# EAGLE design SDC project (EAGLE 9.1.3)
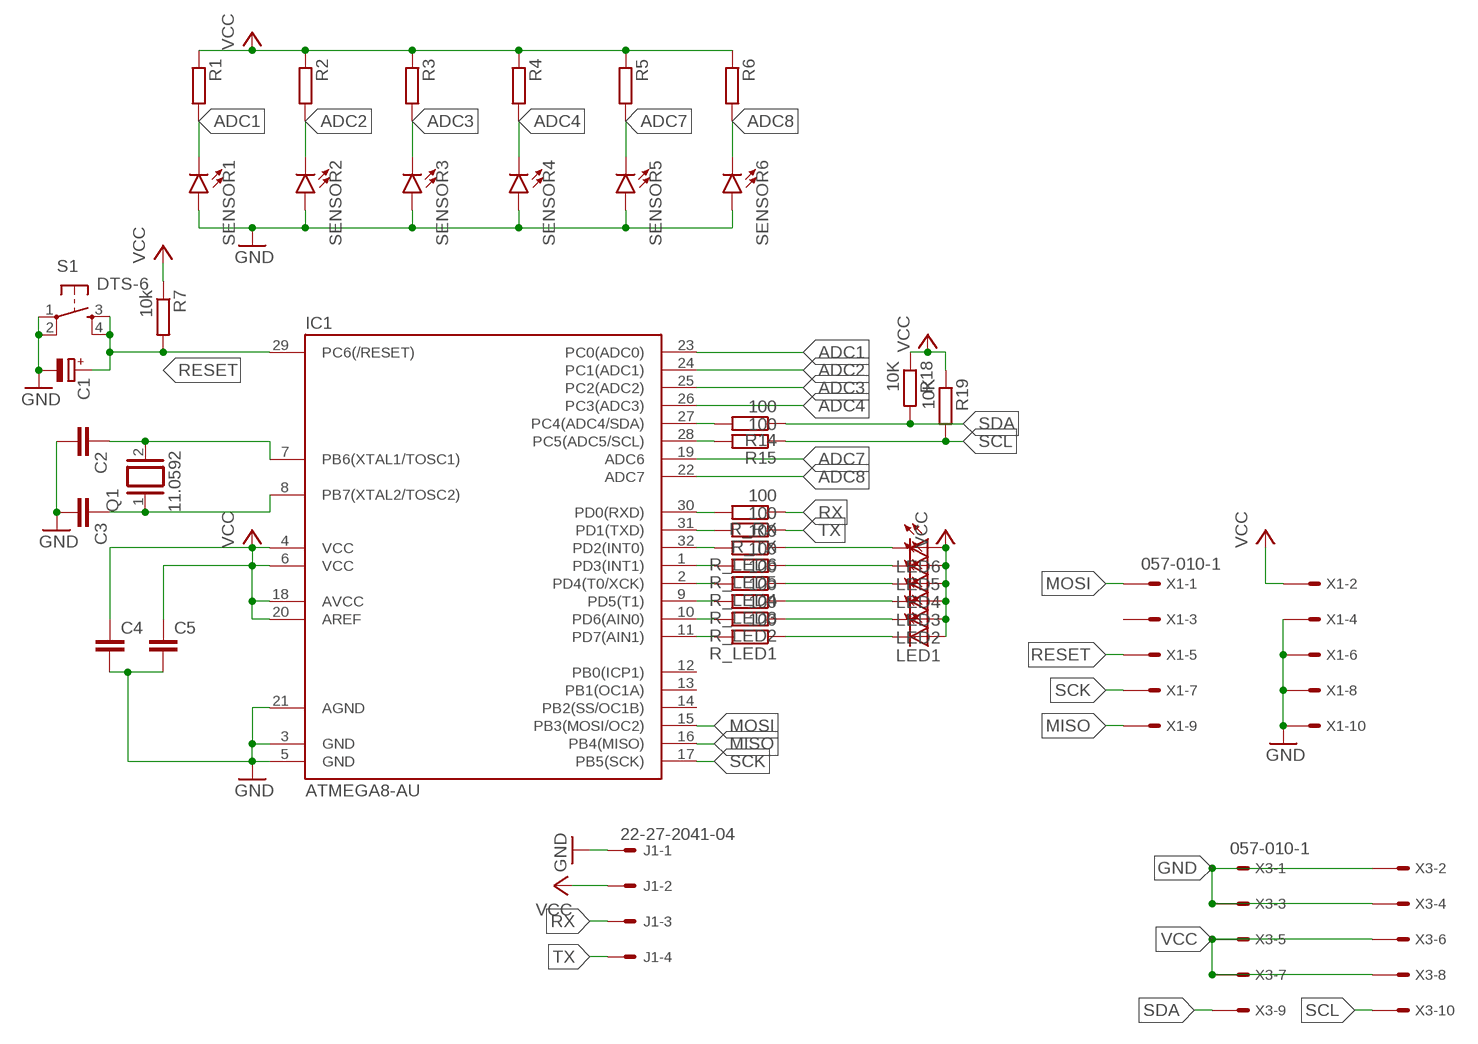
[diagram p0: schematic, sheet 1]

## Parts
C1  CPOL-EUE2.5-5  [E2,5-5]
C2  C5/2.5  [C5B2.5]
C3  C5/2.5  [C5B2.5]
C4  C-EUC1206  [C1206]
C5  C-EUC1206  [C1206]
IC1  ATMEGA8-AU  [TQFP32-08]
J1  22-27-2041-04  [6410-04]
LED1  LEDSML0805  [SML0805]
LED2  LEDSML0805  [SML0805]
LED3  LEDSML0805  [SML0805]
LED4  LEDSML0805  [SML0805]
LED5  LEDSML0805  [SML0805]
LED6  LEDSML0805  [SML0805]
Q1  11.0592  XTAL/S  [QS]
R1  R-EU_R0805  [R0805]
R2  R-EU_R0805  [R0805]
R3  R-EU_R0805  [R0805]
R4  R-EU_R0805  [R0805]
R5  R-EU_R0805  [R0805]
R6  R-EU_R0805  [R0805]
R7  10k  R-EU_R0805  [R0805]
R14  100  R-EU_R0805  [R0805]
R15  100  R-EU_R0805  [R0805]
R18  10K  R-EU_R0805  [R0805]
R19  10K  R-EU_R0805  [R0805]
R_LED1  100  R-EU_R0805  [R0805]
R_LED2  100  R-EU_R0805  [R0805]
R_LED3  100  R-EU_R0805  [R0805]
R_LED4  100  R-EU_R0805  [R0805]
R_LED5  100  R-EU_R0805  [R0805]
R_LED6  100  R-EU_R0805  [R0805]
R_RX  100  R-EU_R0805  [R0805]
R_TX  100  R-EU_R0805  [R0805]
S1  DTS-6  [DTS-6]
SENSOR1  LED5MM  [LED_5MM]
SENSOR2  LED5MM  [LED_5MM]
SENSOR3  LED5MM  [LED_5MM]
SENSOR4  LED5MM  [LED_5MM]
SENSOR5  LED5MM  [LED_5MM]
SENSOR6  LED5MM  [LED_5MM]
X1  057-010-1  [057-010-1]
X3  057-010-1  [057-010-1]

## Nets
ADC1: IC1.23(PC0(ADC0)) R1.2 SENSOR1.K(C)
ADC2: IC1.24(PC1(ADC1)) R2.2 SENSOR2.K(C)
ADC3: IC1.25(PC2(ADC2)) R3.2 SENSOR3.K(C)
ADC4: IC1.26(PC3(ADC3)) R4.2 SENSOR4.K(C)
ADC7: IC1.19(ADC6) R5.2 SENSOR5.K(C)
ADC8: IC1.22(ADC7) R6.2 SENSOR6.K(C)
GND: C1.- C2.2 C3.2 C4.2 C5.2 IC1.3(GND) IC1.5(GND) IC1.21(AGND) J1.1 S1.1 S1.2 SENSOR1.A SENSOR2.A SENSOR3.A SENSOR4.A SENSOR5.A SENSOR6.A X1.4 X1.6 X1.8 X1.10 X3.1 X3.2 X3.3 X3.4
MISO: IC1.16(PB4(MISO)) X1.9
MOSI: IC1.15(PB3(MOSI/OC2)) X1.1
N$1: IC1.30(PD0(RXD)) R_RX.2
N$2: IC1.31(PD1(TXD)) R_TX.2
N$7: IC1.27(PC4(ADC4/SDA)) R14.2
N$8: C2.1 IC1.7(PB6(XTAL1/TOSC1)) Q1.2
N$9: C3.1 IC1.8(PB7(XTAL2/TOSC2)) Q1.1
N$10: IC1.28(PC5(ADC5/SCL)) R15.2
N$13: IC1.32(PD2(INT0)) R_LED6.2
N$14: IC1.1(PD3(INT1)) R_LED5.2
N$15: IC1.2(PD4(T0/XCK)) R_LED4.2
N$16: IC1.9(PD5(T1)) R_LED3.2
N$17: IC1.10(PD6(AIN0)) R_LED2.2
N$18: IC1.11(PD7(AIN1)) R_LED1.2
N$19: LED6.C R_LED6.1
N$20: LED5.C R_LED5.1
N$21: LED4.C R_LED4.1
N$22: LED3.C R_LED3.1
N$23: LED2.C R_LED2.1
N$24: LED1.C R_LED1.1
RESET: C1.+ IC1.29(PC6(/RESET)) R7.2 S1.3 S1.4 X1.5
RX: J1.3 R_RX.1
SCK: IC1.17(PB5(SCK)) X1.7
SCL: R15.1 R19.2 X3.10
SDA: R14.1 R18.2 X3.9
TX: J1.4 R_TX.1
VCC: C4.1 C5.1 IC1.4(VCC) IC1.6(VCC) IC1.18(AVCC) IC1.20(AREF) J1.2 LED1.A LED2.A LED3.A LED4.A LED5.A LED6.A R1.1 R2.1 R3.1 R4.1 R5.1 R6.1 R7.1 R18.1 R19.1 X1.2 X3.5 X3.6 X3.7 X3.8
Unconnected: IC1.12(PB0(ICP1)) IC1.13(PB1(OC1A)) IC1.14(PB2(SS/OC1B)) X1.3

## Library data of the parts
C1 = rcl:CPOL-EU: POLARIZED CAPACITOR, European symbol; SPICEPREFIX: C
C2 C3 = capacitor-wima:C: CAPACITOR naming: grid - package width
C4 C5 = rcl:C-EU: CAPACITOR, European symbol; SPICEPREFIX: C
IC1 = atmega8:ATMEGA8
J1 = con-molex:22-?-04: CONNECTOR wire to board 2.54 mm (.1 inch) pitch header; MF: MOLEX; OC_FARNELL: unknown; OC_NEWARK: unknown
LED1-LED6 = led:LED: LED OSRAM: - CHIPLED LG R971, LG N971, LY N971, LG Q971, LY Q971, LO R971, LY R971 LH N974, LH R974 LS Q976, LO Q976, LY Q976 LO Q996 - Hyper CHIPLED LW Q18S LB Q993, LB Q99A, LB R99A - SideLED LS A670, LO A670, LY A670, LG A670, LP A670 LB A673, LV A673, LT A673, LW A673 LH A674 LY A675 LS A676, LA A676, LO A676, LY A676, LW A676 LS A679, LY A679, LG A679 - Hyper Micro SIDELED® LS Y876, LA Y876, LO Y876, LY Y876 LT Y87S - SmartLED LW L88C, LW L88S LB L89C, LB L89S, LG L890 LS L89K, LO L89K, LY L89K LS L896, LA L896, LO L896, LY L896 - TOPLED LS T670, LO T670, LY T670, LG T670, LP T670 LSG T670, LSP T670, LSY T670, LOP T670, LYG T670 LG T671, LOG T671, LSG T671 LB T673, LV T673, LT T673, LW T673 LH T674 LS T676, LA T676, LO T676, LY T676, LB T676, LH T676, LSB T676, LW T676 LB T67C, LV T67C, LT T67C, LS T67K, LO T67K, LY T67K, LW E67C LS E67B, LA E67B, LO E67B, LY E67B, LB E67C, LV E67C, LT E67C LW T67C LS T679, LY T679, LG T679 LS T770, LO T770, LY T770, LG T770, LP T770 LB T773, LV T773, LT T773, LW T773 LH T774 LS E675, LA E675, LY E675, LS T675 LS T776, LA T776, LO T776, LY T776, LB T776 LHGB T686 LT T68C, LB T68C - Hyper Mini TOPLED® LB M676 - Mini TOPLED Santana® LG M470 LS M47K, LO M47K, LY M47K Source: http://www.osram.convergy.de LUXEON: - LUMILED® LXK2-PW12-R00, LXK2-PW12-S00, LXK2-PW14-U00, LXK2-PW14-V00 LXK2-PM12-R00, LXK2-PM12-S00, LXK2-PM14-U00 LXK2-PE12-Q00, LXK2-PE12-R00, LXK2-PE12-S00, LXK2-PE14-T00, LXK2-PE14-U00 LXK2-PB12-K00, LXK2-PB12-L00, LXK2-PB12-M00, LXK2-PB14-N00, LXK2-PB14-P00, LXK2-PB14-Q00 LXK2-PR12-L00, LXK2-PR12-M00, LXK2-PR14-Q00, LXK2-PR14-R00 LXK2-PD12-Q00, LXK2-PD12-R00, LXK2-PD12-S00 LXK2-PH12-R00, LXK2-PH12-S00 LXK2-PL12-P00, LXK2-PL12-Q00, LXK2-PL12-R00 Source: www.luxeon.com KINGBRIGHT: KA-3528ASYC Source: www.kingbright.com
Q1 = special:XTAL/S: CRYSTAL
R1-R7 R14 R15 R18 R19 R_LED1-R_LED6 R_RX R_TX = rcl:R-EU_: RESISTOR, European symbol; SPICEPREFIX: R
S1 = switch-tact:DTS-6
SENSOR1-SENSOR6 = SparkFun-LED:LED: LED (Generic) Standard schematic elements and footprints for 5mm, 3mm, 1206, and 0603 sized LEDs. Generic LEDs with no color specified.
X1 X3 = con-panduit:057-010-: CONNECTOR 10-pin series 057 contact pc board low profile headers; OC_FARNELL: unknown; OC_NEWARK: unknown

## Board
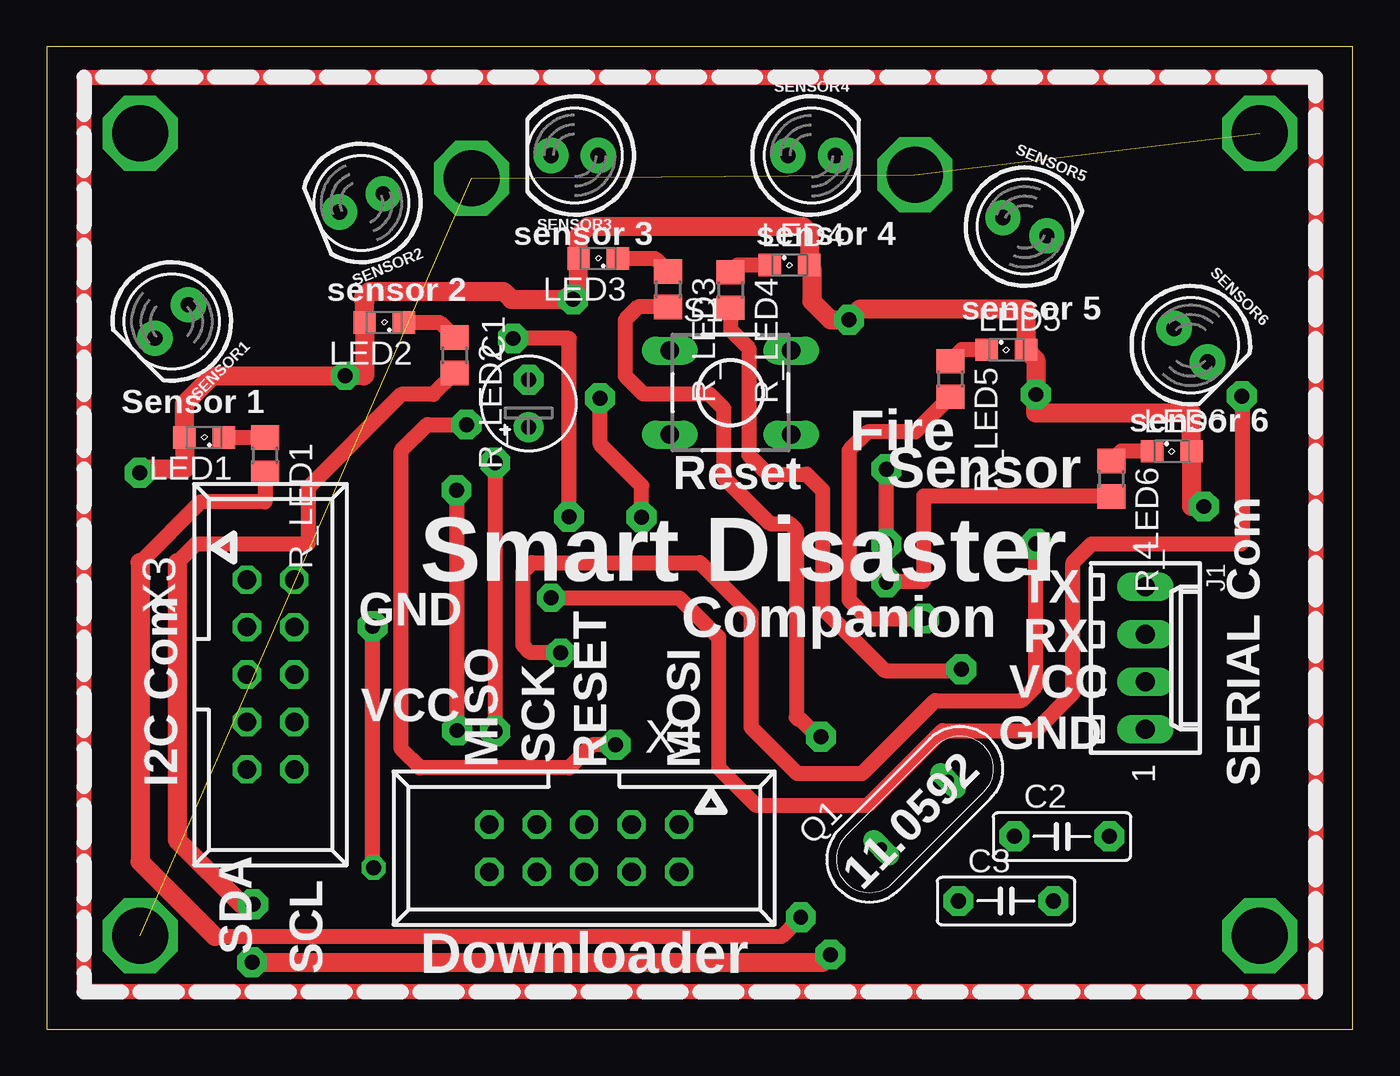
[diagram p1: board, top side]
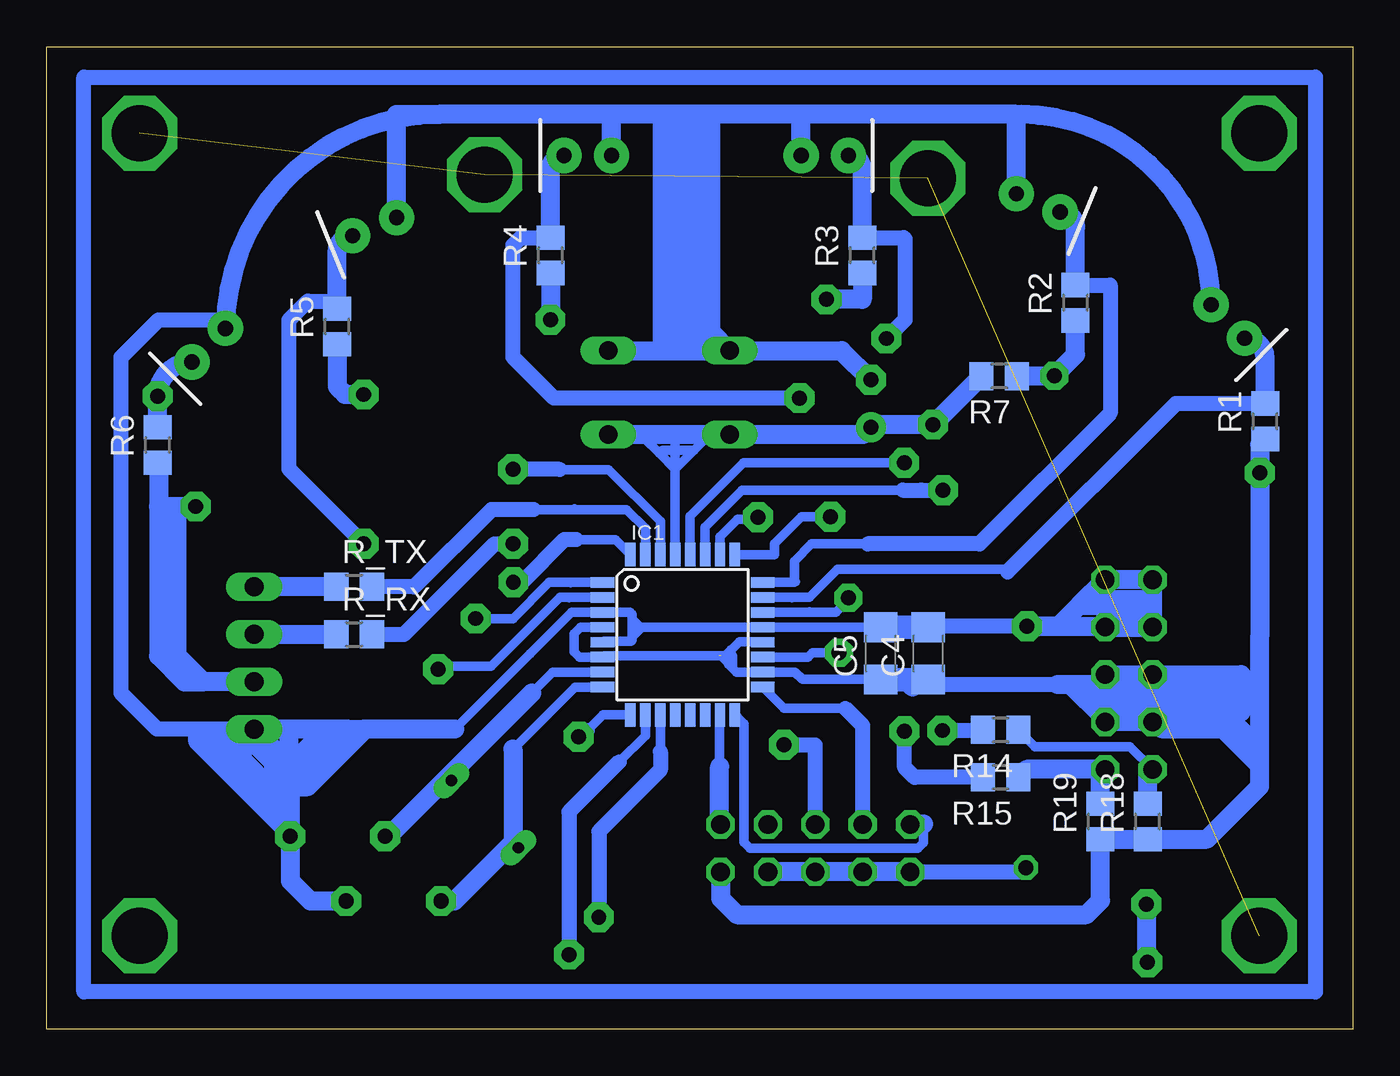
[diagram p2: board, bottom side, seen from below]

Size 69.99 x 52.63 mm. Coordinates in mm from the lower left corner, seen from the top.
Outline: 0,0 69.99,0 69.99,52.63 0,52.63 0,0
Copper layers (1*16): Top 0.035mm / dielectric 1.5mm / Bottom 0.035mm
Design rules "default": minimum track width 6mil, minimum drill 0.35mm, track to track 6mil, track to pad 6mil, pad to pad 6mil, via to via 6mil, smd to smd 6mil, copper to edge 40mil, drill to drill 6mil, minimum pad ring 10mil, minimum via ring 8mil, stop-mask expansion 4mil, vias tented up to drill 0mil, thermal gap 10mil

### Footprints (pad centres in the part's own frame; a part is rotated, then mirrored left to right if it is on the bottom)
E2,5-5 = drill 0.813 pad 1.6: + -1.27,0 | drill 0.813 pad 1.6 octagon: - 1.27,0
C5B2.5 = drill 0.813 pad 1.6 octagon: 1 -2.54,0; 2 2.54,0
C1206 = smd 1.6 x 1.8: 1 -1.4,0; 2 1.4,0
TQFP32-08 = smd 1.27 x 0.559: 1 -4.293,2.8; 2 -4.293,2; 3 -4.293,1.2; 4 -4.293,0.4; 5 -4.293,-0.4; 6 -4.293,-1.2; 7 -4.293,-2; 8 -4.293,-2.8; 17 4.293,-2.8; 18 4.293,-2; 19 4.293,-1.2; 20 4.293,-0.4; 21 4.293,0.4; 22 4.293,1.2; 23 4.293,2; 24 4.293,2.8 | smd 0.559 x 1.27: 9 -2.8,-4.293; 10 -2,-4.293; 11 -1.2,-4.293; 12 -0.4,-4.293; 13 0.4,-4.293; 14 1.2,-4.293; 15 2,-4.293; 16 2.8,-4.293; 25 2.8,4.293; 26 2,4.293; 27 1.2,4.293; 28 0.4,4.293; 29 -0.4,4.293; 30 -1.2,4.293; 31 -2,4.293; 32 -2.8,4.293
6410-04 = drill 1.016 long: 1 3.81,0; 2 1.27,0; 3 -1.27,0; 4 -3.81,0
SML0805 = smd 1.2 x 1.2: A 1.05,0; C -1.05,0
QS = drill 0.61 long: 1 -2.54,0; 2 2.54,0
R0805 = smd 1.3 x 1.5: 1 -0.95,0; 2 0.95,0
DTS-6 = drill 1 long: 1 -3.25,2.25; 2 3.25,2.25; 3 -3.25,-2.25; 4 3.25,-2.25
LED_5MM = drill 0.813 pad 1.88: A -1.27,0; K 1.27,0
057-010-1 = drill 1 octagon: 1 -5.08,-1.27; 2 -5.08,1.27; 3 -2.54,-1.27; 4 -2.54,1.27; 5 0,-1.27; 6 0,1.27; 7 2.54,-1.27; 8 2.54,1.27; 9 5.08,-1.27; 10 5.08,1.27

### Placement (x,y rotation side)
C1  25.83,33.52 90 top
C2  54.4,10.33 0 top
C3  51.4,6.87 0 top
C4  22.75,20.13 90 bottom
C5  25.29,20.13 90 bottom
IC1  35.91,21.13 0 bottom
J1  58.87,19.88 270 top
LED1  8.44,31.7 180 top
LED2  18.09,37.86 180 top
LED3  29.55,41.29 180 top
LED4  39.8,40.92 0 top
LED5  51.43,36.4 0 top
LED6  60.29,30.96 0 top
Q1  46.51,11.52 45 top
R1  4.7,32.56 90 bottom
R2  14.86,38.91 90 bottom
R3  26.29,41.45 90 bottom
R4  42.99,41.45 90 bottom
R5  54.42,37.64 90 bottom
R6  64.04,31.29 90 bottom
R7  18.95,34.98 180 bottom
R14  18.87,16.03 180 bottom
R15  18.87,13.49 180 bottom
R18  11,11.13 90 bottom
R19  13.53,11.13 90 bottom
R_LED1  11.7,30.75 270 top
R_LED2  21.86,36.1 270 top
R_LED3  33.29,39.64 270 top
R_LED4  36.65,39.6 270 top
R_LED5  48.42,34.83 270 top
R_LED6  57.04,29.48 270 top
R_RX  53.52,21.15 0 bottom
R_TX  53.52,23.69 0 bottom
S1  36.64,34.1 0 top
SENSOR1  6.7,37.91 225 top
SENSOR2  16.86,44.26 202.5 top
SENSOR3  28.29,46.8 180 top
SENSOR4  40.99,46.8 0 top
SENSOR5  52.42,42.99 337.5 top
SENSOR6  61.31,36.64 315 top
X1  28.8,9.7 180 top
X3  12,19 270 top

### Tracks (layer width: path | path; a pad name or v marks a point on that pad's centre or on a via)
ADC1
  Bottom 0.508: IC1.23 30.06,23.13 | 30.06,23.13 30.05,23.12 | 30.06,23.13 29.12,23.13 27.61,24.63 18.63,24.63 18.5,24.5
  Bottom 0.813: R1.2 9.49,33.51 18.5,24.5
  Bottom 1.016: R1.2 4.7,35.91 arc-90 SENSOR1.K
ADC2
  Bottom 0.508: IC1.24 29.93,23.93 | 29.93,23.93 29.88,23.98 | 26,26 29,26 29.93,25.07 29.93,23.93
  Bottom 0.813: R2.2 13,39.86 13,33 20,26 26,26
  Bottom 1.016: R2.2 14.86,42.95 arc-90 SENSOR2.K
ADC3  (via drill 0.8 pad 1.6)
  Top 0.813: v25,37 28,37 28,27.47 v27.98,27.45
  Bottom 0.508: v27.98,27.45 29.55,27.45 31,26 31,25.42 IC1.25
  Bottom 0.813: R3.2 24.07,42.4 24,42.33 24,38 v25,37 | 27.98,27.04 v27.98,27.45
  Bottom 1.016: R3.2 26.29,46.07 arc-90 SENSOR3.K
ADC4  (via drill 0.8 pad 1.6)
  Top 0.813: v31.88,27.43 31.88,29.12 29.65,31.35 29.65,33.76 29.65,33.77 v29.65,33.81
  Bottom 0.508: IC1.26 33.91,26.38 32.97,27.31 31.96,27.31 31.92,27.27 31.88,27.31 v31.88,27.43
  Bottom 0.813: v29.65,33.81 42.81,33.81 45,36 45,42 44.6,42.4 R4.2
  Bottom 1.016: R4.2 42.99,46.07 arc90 SENSOR4.K
ADC7  (via drill 0.8 pad 1.5, 0.8 pad 1.6)
  Top 0.813: v27.55,20.18 25.91,20.18 25.52,20.57 25.52,24.52 26,25 35,25 37.75,22.25 37.75,16.17 40.21,13.7 43.7,13.7 47.61,17.61 52.23,17.61 53,18.38 v53,26
  Bottom 0.508: IC1.19 29.2,19.93 28.95,20.18 v27.55,20.18 27.5,20.18
  Bottom 0.813: v53,26 57,30 57,38 56,39 54.42,39
  Bottom 1.016: R5.2 54.42,39 54.42,41.68 arc90 SENSOR5.K
ADC8  (via drill 0.8 pad 1.5, 0.8 pad 1.6)
  Top 0.813: v27.03,23.11 33.89,23.11 36,21 36,14 38,12 44,12 48,16 53,16 55,18 55,25 56,26 64,26 64.08,26.08 64.08,33.91 v64.04,33.91
  Bottom 0.508: IC1.22 29.13,22.33 | 29.13,22.33 29.11,22.36 | 29.13,22.33 27.7,22.33 27.27,22.77
  Bottom 0.813: 27.27,22.77 27.03,23.01 v27.03,23.11
  Bottom 1.016: R6.2 v64.04,33.91 arc90 SENSOR6.K
D  (via drill 3 pad 3.5)  (3 unrouted)
  other vias: 65,48 22.76,45.59 46.53,45.78 5,5
GND  (via drill 0.8 pad 1.3, 0.8 pad 1.6)
  Top 0.813: v17.46,21.58 17.46,8.71 v17.52,8.66
  Bottom 0.508: 38.63,22 38.63,22.23 38.72,22.33 IC1.3 41.86,22.33 44.08,20.11 48.12,16.07 | 38.63,22 38.63,21 | 38.63,21 38.63,20.84 38.67,20.8 40.14,20.8 IC1.5 | 38.1,21.53 IC1.21 C5.2 | 38.1,21.53 38.16,21.53 38.63,22 | 38.1,21.53 38.63,21
  Bottom 0.813: v17.46,21.58 22.7,21.58 C4.2 | X1.10 17.68,8.43 17.52,8.59 v17.52,8.66 | J1.1 61,16.07 | 61,16.07 61.53,16.07 | 61.53,16.07 62,16.07 | 62,16.07 64.07,16.07 66,18 66,36 64,38 60.87,38 SENSOR6.A | C2.2 57.8,11.2 | 57.8,11.2 62,15.39 62,16.07 | 59.42,14.48 61,16.06 61,16.07 | 57.8,11.2 57.68,11.32 57.68,11.83 61.53,15.68 61.53,16.07 | 57.54,13 57.54,12.6 56.94,12 | 57.54,13 57.54,13.86 57.94,14.25 | 57.94,14.25 59.09,15.41 59.42,15.41 59.42,14.48 | 57.54,13 57.94,13 | 57.94,13 59.42,14.48 | 57.94,13 57.94,14.25
  Bottom 1.016: S1.1 27.39,36.35 C1.- | X1.10 X1.8 X1.6 X1.4 | C3.2 55.87,6.87 56.94,7.94 C2.2 56.94,12 56.94,13 | 56.94,14.14 J1.1 57,16.07 | 56.94,14.14 56.94,13 | 48.12,16.07 53,16.07 | 53.87,16.07 55.01,16.07 | 55.01,16.07 57,16.07 | 56.94,13 55.97,13.97 | 55.97,13.97 53.87,16.07 | 53.87,16.07 53,16.07 | 56.94,14.14 55.01,16.07 | 55.97,13.97 57,15 57,16.07 | 56.94,13 56,13 53,16 53,16.07 | SENSOR1.A arc-90 17.79,49 18.03,49 | 48.95,49 arc-90 SENSOR6.A | 18.03,49 29.56,49 | 29.56,49 34.39,49 | 34.39,49 35,49 | 35,49 36,49 | 36,49 37,49 | 37,49 39.72,49 | 39.72,49 48.95,49 | SENSOR5.A 51.25,49 48.95,49 | SENSOR4.A 39.72,49 | SENSOR3.A 29.56,49 | SENSOR2.A 18.03,49 | S1.2 37,36.35 | 37,36.35 36,36.35 | 36,36.35 36,49 | 36,36.35 35,36.35 | 35,36.35 S1.1 | 35,36.35 35,49 | 37,36.35 37,49 | 34.39,49 34.39,37.35 S1.1 | X3.4 13.31,21.58 v17.46,21.58 15.77,21.58 14.68,22.68 | X3.4 X3.3 10.73,23 | 10.73,23 X3.1 X3.2 | X3.2 13.27,23 | 13.27,23 13.27,22 | 13.27,22 X3.4 | 10.73,23 13.27,23 | 10.73,23 11.73,22 13.27,22 | X3.2 14.68,22.68 | 13.27,23 13.59,22.68 14.68,22.68
  Bottom 1.27: C4.2 C5.2
MISO
  Bottom 0.508: 32.84,16.56 IC1.16 32.62,16.35 32.62,10.02 32.29,9.69 23.31,9.69 23,10 23,11
  Bottom 1.016: X1.9 23.69,11 23,11
MOSI
  Bottom 0.508: 33.93,14.07 33.93,16.82 IC1.15
  Bottom 1.016: X1.1 33.93,11.02 33.93,14.07
N$1  (via drill 0.8 pad 1.6)
  Top 0.813: v45,26 v45,30
  Bottom 0.508: IC1.30 37.11,27.2 39.89,29.98 42.49,29.98
  Bottom 0.813: R_RX.2 50.85,21.15 46,26 v45,26 | v45,30 44.98,29.98 42.5,29.98 42.49,29.98
N$2
  Bottom 0.508: IC1.31 37.91,26.83 38.92,27.84 41.65,27.84 | 41.65,27.84 41.7,27.89 | 41.65,27.84 43.89,27.84
  Bottom 0.813: 43.89,27.84 46.16,27.84 50.31,23.69 R_TX.2
N$3
  Top 0.813: 2,51 68,51 68,2 2,2 2,51
N$4  (via drill 3 pad 3.5)
  other vias: 5,48
N$6  (via drill 3 pad 3.5)
  other vias: 65,5
N$7  (via drill 0.8 pad 1.6)
  Top 0.813: v21.95,28.88 21.95,16.05 v22,16
  Bottom 0.508: IC1.27 34.71,26.88 32.72,28.87 32,28.87 | 32,28.87 31.69,28.87 | 32,28.87 24.13,28.87 24,29
  Bottom 0.813: R14.2 19.85,16 v22,16 | 24.13,28.87 23.13,28.87 23.12,28.88 v21.95,28.88
N$8
  Bottom 0.508: IC1.7 42.12,19.13 | 42.12,19.13 42.13,19.13 | 42.12,19.13 42.87,19.13 44,18
  Bottom 1.016: 44,18 48.31,13.69 | 48.31,13.69 Q1.2 | C2.1 51.67,10.33 48.31,13.69
N$9
  Bottom 0.508: IC1.8 41.67,18.33 45,15
  Bottom 1.016: 45,15 45,10.01 | 45,10.01 Q1.1 | C3.1 48.14,6.87 45,10.01
N$10  (via drill 0.8 pad 1.6)
  Top 0.813: v24.02,15.96 24.02,30.32 v24.04,30.34
  Bottom 0.508: IC1.28 35.51,27.49 32.66,30.34 v24.04,30.34
  Bottom 0.813: R15.2 23.49,13.49 24.02,14.02 v24.02,15.96
N$11
  Bottom 0.813: 2,51 2,2 68,2 68,51 2,51
N$13  (via drill 0.8 pad 1.6)
  Top 0.813: v44.98,23.95 45.03,24 47,24 47,28.56 57.01,28.56 R_LED6.2
  Bottom 0.508: IC1.32 39.5,26.22 41,26.22 41.6,26.22
  Bottom 0.813: 41.6,26.22 42.25,26.22 44.52,23.95 v44.98,23.95
N$14  (via drill 0.8 pad 1.6)
  Top 0.813: R_LED5.2 46.54,32 44,32 43,31 43,23 44,22 v47,22
  Bottom 0.508: IC1.1 41.89,23.93 | 41.89,23.93 41.92,23.91 | 41.89,23.93 43.07,23.93 45,22 v47,22
N$15  (via drill 0.8 pad 1.6)
  Top 0.813: R_LED4.2 36.65,37.45 37.63,36.47 37.63,30.76 38.65,29.74 40.72,29.74 41.58,28.88 41.58,22.54 44.91,19.21 48.9,19.21 48.94,19.17 49.02,19.25 v49.02,19.29
  Bottom 0.508: IC1.2 42,23.13 | 42,23.13 42.01,23.12 | 42,23.13 42.49,23.13 46.16,19.45 48.85,19.45
  Bottom 0.813: v49.02,19.29 48.85,19.45
N$16  (via drill 0.8 pad 1.6)
  Top 0.813: R_LED3.2 31.69,38.69 31,38 31,35 31.97,34.03 35.5,34.03 36.28,33.25 36.28,29.56 38.76,27.08 39.82,27.08 40.17,26.73 40.17,16.7 40.25,16.63 40.37,16.63 41.34,15.66 v41.48,15.66
  Bottom 0.508: IC1.9 40.19,16.84 41.01,16.01 41.02,16.01
  Bottom 0.813: v41.48,15.66 41.13,16.01 41.01,16.01
N$17  (via drill 0.8 pad 1.6)
  Top 0.813: R_LED2.2 20.71,34 19,34 14,29 14,25.98 7.98,25.98 7,25 | 41.93,3.94 41.94,3.94 v42,4
  Top 1.016: 7,25 7,10.13 10.44,6.7 v11.06,6.7 | v11,3.58 41.57,3.58 41.93,3.94
  Bottom 0.508: IC1.10 37.91,15.73 39.32,14.32 39.64,14
  Bottom 0.813: 39.32,14.32 42,11.64 v42,4
  Bottom 1.016: v11.06,6.7 11.06,3.64 v11,3.58
N$18  (via drill 0.8 pad 1.6)
  Top 0.813: R_LED1.2 11.7,28.24 8.24,28.24 5,25 | 9.02,4.96 39.37,4.96 v40.4,6
  Top 1.016: 5,25 5,8.98 9.02,4.96
  Bottom 0.508: IC1.11 37.11,14.87
  Bottom 0.813: 37.11,14.87 37.11,13.89 40.4,10.6 v40.4,6
N$19
  Top 0.813: LED6.C 57.57,30.96 R_LED6.1
N$20
  Top 0.813: LED5.C 49.04,36.4 R_LED5.1
N$21
  Top 0.813: LED4.C 37.02,40.92 R_LED4.1
N$22
  Top 0.813: LED3.C 32.59,41.29 R_LED3.1
N$23
  Top 0.813: LED2.C 21.05,37.86 R_LED2.1
N$24
  Top 0.813: LED1.C R_LED1.1
RESET  (via drill 0.8 pad 1.6)
  Top 0.813: v30.48,15.23 29.23,15.23 28,14 20,14 19,15 19,31 20.39,32.39 v22.49,32.39
  Bottom 0.508: IC1.29 36.31,30 | 36.31,30 36.31,31 | 36.31,31 36.31,31.54 36,31.85 | 36.31,30 37.16,30.84 | 37.16,30.84 38,31.69 38,31.85 | 36.31,30 35.31,31 | 35.31,31 34.46,31.85 34,31.85 | 36.31,31 35.31,31 | 36.31,31 37,31 37.16,30.84
  Bottom 0.813: X1.5 28.8,15.23 v30.48,15.23
  Bottom 1.016: S1.4 38,31.85 36,31.85 34,31.85 S1.3 26.23,31.85 C1.+ 25.97,32.39 v22.49,32.39 R7.2
RX
  Bottom 1.016: J1.3 R_RX.1
SCK
  Bottom 0.508: 27.19,17.19 30.48,17.19 IC1.17
  Bottom 0.813: 27.19,17.19 26.26,16.26 X1.7
SCL
  Bottom 1.016: R19.2 13.53,13.66 X3.10 17.49,13.92 R15.1
SDA
  Bottom 0.508: X3.9 11.95,15.14 17.03,15.14 R14.1
  Bottom 1.016: R18.2 11,13.65 X3.9
TX
  Bottom 1.016: R_TX.1 J1.4
VCC  (via drill 0.8 pad 1.5, 0.8 pad 1.6)  (1 unrouted)
  Top 1.016: v62,28 61.34,28 LED6.A 61.34,33 53,33 v53,34 53,35.87 LED5.A 52.48,38.59 43.59,38.59 v43,38 42,38 41,39 41,40.78 LED4.A 40.88,40.95 40.88,42.65 40.52,43 29,43 28.5,42.5 LED3.A 28.5,39.38 v28.21,39.09 24.91,39.09 24.48,39.52 17.28,39.52 17,39.24 17,39 17.04,38.96 LED2.A 17.04,35.04 17,35 v16,35 8.88,35 7.39,33.51 LED1.A 7.39,30.01 5.2,30.01 v4.99,29.8
  Bottom 0.508: 33.46,20 33.46,20.17 32.86,20.76 31.65,20.76 IC1.20 | 33.96,20 40.13,20 IC1.6 41.35,19.93 | 33.64,20 33.87,20 33.46,19.59 | 33.64,20 33.31,20.33 | 33.64,20 33.46,20 | 33.46,19.59 33.46,19.55 33.04,19.13 IC1.18 29.88,19.13 29.49,18.74 C5.1 | 33.46,20 33.24,20 33.24,19.37 33.46,19.59 | IC1.4 41.38,21.53 41.73,21.19 41.73,20.23 41.43,19.93 41.35,19.93 | 41.35,19.93 | 4.99,21.01 5,21
  Bottom 0.813: 15.81,18.46 16,18.46 | 16,18.46 22.48,18.46 C4.1 | X3.8 15.27,18.46 16,18.46 | 15,18.46 14.54,18 13.27,18 | X3.7 10.27,16 7,16 5,14
  Bottom 1.016: R1.1 4.99,31.32 v4.99,29.8 4.99,21.01 | 5,21 5,20 5,19 5,18 | 5,18 5,17 | 5,17 5,15 | 5,15 5,14 5,13 7.82,10.18 R18.1 R19.1 13.52,6.89 | X1.2 33.88,7.01 33.01,6.14 14.27,6.14 13.52,6.89 | 13.52,6.89 13.53,6.89 | R2.1 14.86,36.14 v16,35 17.98,35 R7.1 | 23.59,18.32 24,18.73 | R3.1 26.29,39.09 v28.21,39.09 | R4.1 v43,38 | R5.1 54.42,34.42 54,34 v53,34 | R6.1 64,30.3 64,28 | 64,28 63,28 | 63,28 v62,28 | J1.2 61.61,18.61 | 61.61,18.61 63,20 63,28 | 64,28 64,20 62.61,18.61 61.61,18.61 | X3.7 X3.8 | X3.8 13.27,18 | 13.27,18 X3.6 | X3.6 X3.5 | X3.5 10.73,18 | 10.73,18 10.73,17 | 10.73,17 X3.7 | X3.6 13.81,18.46 15,18.46 15.81,18.46 | 10.73,18 13.27,18 | X3.8 12.73,17 10.73,17 | X3.7 6.46,16.46 5,15 | X3.5 6,19 5,18 | 10.73,18 6,18 5,17 | 10.73,18 | 10.73,18 10,17.27 | 10,17.27 10,17 | 10,17.27 6.27,17.27 6,17
  Bottom 1.27: C4.1 24,18.73 C5.1

### Text on the board
tSilk: sensor 3 | sensor 4 | sensor 2 | sensor 5 | Sensor 1 | sensor 6 | Fire | Reset | Sensor | Smart Disaster | TX | GND | Companion | RX | VCC | VCC | GND | MISO | SCK | RESET | MOSI | I2C Com | SERIAL Com | SCL | 11.0592 | SDA | Downloader